# EAGLE schematic PNP_carrier_footprints (EAGLE 9.6.2)
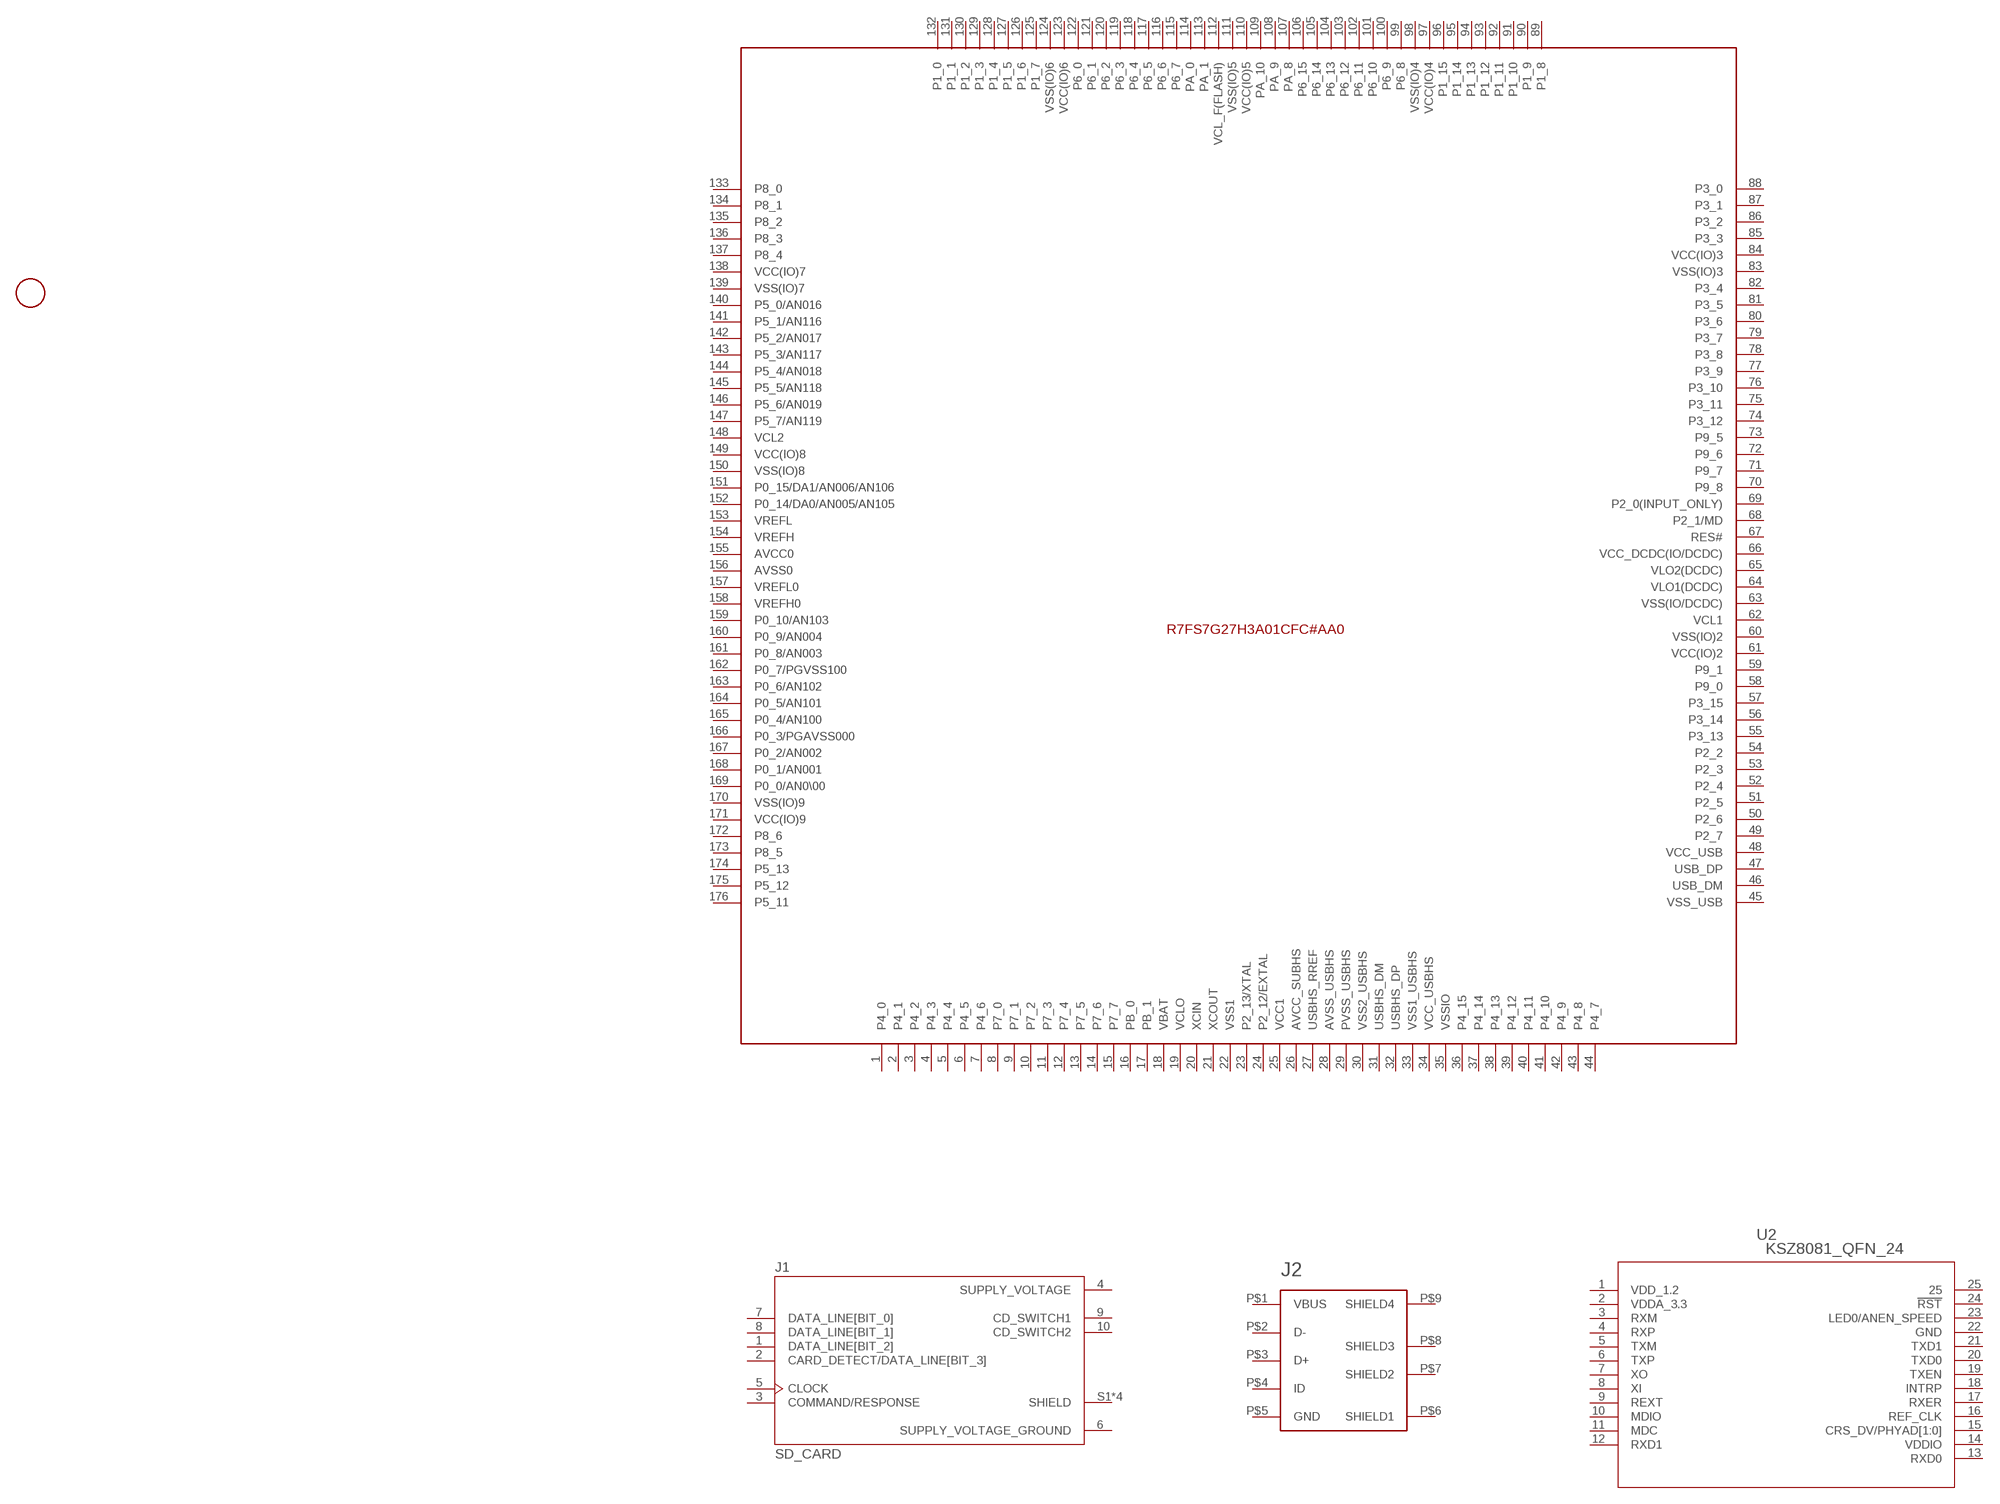
[diagram p0: schematic, sheet 1]

## Parts
J1  SD_CARD  SD_CARD_1140084168  [SD_CARD]
J2  USB-B-Micro  USB_MICRO-B  [USB_MICRO-B]
U1  S7G2LQFP176  RENESAS_S7G2_X_176  [LQFP176_24X24]
U2  KSZ8081_QFN_24  KSZ8081RNACAQFN-24-M  [QFN-24-M]
U$1  FIDUCIAL_1MM  [FIDUCIAL_1MM]
Unconnected: J1.1(DATA_LINE[BIT_2]) J1.2(CARD_DETECT/DATA_LINE[BIT_3]) J1.3(COMMAND/RESPONSE) J1.5(CLOCK) J1.7(DATA_LINE[BIT_0]) J1.8(DATA_LINE[BIT_1]) J1.9(CD_SWITCH1) J1.10(CD_SWITCH2) J1.S1(SHIELD) J1.S2(SHIELD) J1.S3(SHIELD) J1.S4(SHIELD) J2.P$1(VBUS) J2.P$2(D-) J2.P$3(D+) J2.P$4(ID) J2.P$5(GND) J2.P$6(SHIELD1) J2.P$7(SHIELD2) J2.P$8(SHIELD3) J2.P$9(SHIELD4) U1.1(P4_0) U1.2(P4_1) U1.3(P4_2) U1.4(P4_3) U1.5(P4_4) U1.6(P4_5) U1.7(P4_6) U1.8(P7_0) U1.9(P7_1) U1.10(P7_2) U1.11(P7_3) U1.12(P7_4) U1.13(P7_5) U1.14(P7_6) U1.15(P7_7) U1.16(PB_0) U1.17(PB_1) U1.18(VBAT) U1.19(VCLO) U1.20(XCIN) U1.21(XCOUT) U1.22(VSS1) U1.23(P2_13/XTAL) U1.24(P2_12/EXTAL) U1.25(VCC1) U1.26(AVCC_SUBHS) U1.27(USBHS_RREF) U1.28(AVSS_USBHS) U1.29(PVSS_USBHS) U1.30(VSS2_USBHS) U1.31(USBHS_DM) U1.32(USBHS_DP) U1.33(VSS1_USBHS) U1.34(VCC_USBHS) U1.35(VSSIO) U1.36(P4_15) U1.37(P4_14) U1.38(P4_13) U1.39(P4_12) U1.40(P4_11) U1.41(P4_10) U1.42(P4_9) U1.43(P4_8) U1.44(P4_7) U1.45(VSS_USB) U1.46(USB_DM) U1.47(USB_DP) U1.48(VCC_USB) U1.49(P2_7) U1.50(P2_6) U1.51(P2_5) U1.52(P2_4) U1.53(P2_3) U1.54(P2_2) U1.55(P3_13) U1.56(P3_14) U1.57(P3_15) U1.58(P9_0) U1.59(P9_1) U1.60(VSS(IO)2) U1.61(VCC(IO)2) U1.62(VCL1) U1.63(VSS(IO/DCDC)) U1.64(VLO1(DCDC)) U1.65(VLO2(DCDC)) U1.66(VCC_DCDC(IO/DCDC)) U1.67(RES#) U1.68(P2_1/MD) U1.69(P2_0(INPUT_ONLY)) U1.70(P9_8) U1.71(P9_7) U1.72(P9_6) U1.73(P9_5) U1.74(P3_12) U1.75(P3_11) U1.76(P3_10) U1.77(P3_9) U1.78(P3_8) U1.79(P3_7) U1.80(P3_6) U1.81(P3_5) U1.82(P3_4) U1.83(VSS(IO)3) U1.84(VCC(IO)3) U1.85(P3_3) U1.86(P3_2) U1.87(P3_1) U1.88(P3_0) U1.89(P1_8) U1.90(P1_9) U1.91(P1_10) U1.92(P1_11) U1.93(P1_12) U1.94(P1_13) U1.95(P1_14) U1.96(P1_15) U1.97(VCC(IO)4) U1.98(VSS(IO)4) U1.99(P6_8) U1.100(P6_9) U1.101(P6_10) U1.102(P6_11) U1.103(P6_12) U1.104(P6_13) U1.105(P6_14) U1.106(P6_15) U1.107(PA_8) U1.108(PA_9) U1.109(PA_10) U1.110(VCC(IO)5) U1.111(VSS(IO)5) U1.112(VCL_F(FLASH)) U1.113(PA_1) U1.114(PA_0) U1.115(P6_7) U1.116(P6_6) U1.117(P6_5) U1.118(P6_4) U1.119(P6_3) U1.120(P6_2) U1.121(P6_1) U1.122(P6_0) U1.123(VCC(IO)6) U1.124(VSS(IO)6) U1.125(P1_7) U1.126(P1_6) U1.127(P1_5) U1.128(P1_4) U1.129(P1_3) U1.130(P1_2) U1.131(P1_1) U1.132(P1_0) U1.133(P8_0) U1.134(P8_1) U1.135(P8_2) U1.136(P8_3) U1.137(P8_4) U1.138(VCC(IO)7) U1.139(VSS(IO)7) U1.140(P5_0/AN016) U1.141(P5_1/AN116) U1.142(P5_2/AN017) U1.143(P5_3/AN117) U1.144(P5_4/AN018) U1.145(P5_5/AN118) U1.146(P5_6/AN019) U1.147(P5_7/AN119) U1.148(VCL2) U1.149(VCC(IO)8) U1.150(VSS(IO)8) U1.151(P0_15/DA1/AN006/AN106) U1.152(P0_14/DA0/AN005/AN105) U1.153(VREFL) U1.154(VREFH) U1.155(AVCC0) U1.156(AVSS0) U1.157(VREFL0) U1.158(VREFH0) U1.159(P0_10/AN103) U1.160(P0_9/AN004) U1.161(P0_8/AN003) U1.162(P0_7/PGVSS100) U1.163(P0_6/AN102) U1.164(P0_5/AN101) U1.165(P0_4/AN100) U1.166(P0_3/PGAVSS000) U1.167(P0_2/AN002) U1.168(P0_1/AN001) U1.169(P0_0/AN0\00) U1.170(VSS(IO)9) U1.171(VCC(IO)9) U1.172(P8_6) U1.173(P8_5) U1.174(P5_13) U1.175(P5_12) U1.176(P5_11) U2.3(RXM) U2.4(RXP) U2.5(TXM) U2.6(TXP) U2.7(XO) U2.8(XI) U2.9(REXT) U2.10(MDIO) U2.11(MDC) U2.12(RXD1) U2.13(RXD0) U2.15(CRS_DV/PHYAD[1:0]) U2.16(REF_CLK) U2.17(RXER) U2.18(INTRP) U2.19(TXEN) U2.20(TXD0) U2.21(TXD1) U2.23(LED0/ANEN_SPEED) U2.24(!RST) U2.25

## Power pins joined to a net without a drawn wire
GND: U2.22(GND)
SUPPLY_VOLTAGE: J1.4(SUPPLY_VOLTAGE)
SUPPLY_VOLTAGE_GROUND: J1.6(SUPPLY_VOLTAGE_GROUND)
VDD_1.2: U2.1(VDD_1.2)
VDDA_3.3: U2.2(VDDA_3.3)
VDDIO: U2.14(VDDIO)

## Library data of the parts
J1 = 3D_MIG_Controller:SD_CARD_1140084168: Conn; IC Socket; Micro SD; Right Angle; PCB Mount; MicroSD Ser.:: 10 _8 + 2_ Position Card Connector Secure Digital - microSD™ Surface Mount, Right Angle Gold; MF: Amphenol ICC; PARTNO: 114-00841-68; VID: Digikey; VP: 114-00841-68-1-ND; VURL: https://www.digikey.ae/product-detail/en/amphenol-icc-commercial-products/114-00841-68/114-00841-68-1-ND/2187101?utm_source=snapeda&utm_medium=aggregator&utm_campaign=symbol
J2 = 3D_MIG_Controller:USB_MICRO-B; PARTNO: 10118192-0002LF
U1 = 3D_MIG_Controller:RENESAS_S7G2_X_176; PARTNO: R7FS7G27H3A01CFC#AA0
U2 = 3D_MIG_Controller:KSZ8081RNACA; PARTNO: KSZ8081RNACA; VENDOR: Micrel
U$1 = 3D_MIG_Controller:FIDUCIAL_1MM: For use by pick and place machines to calibrate the vision/machine, 1mm By microbuilder.eu